# Altium project MiniBoard.PrjPCB
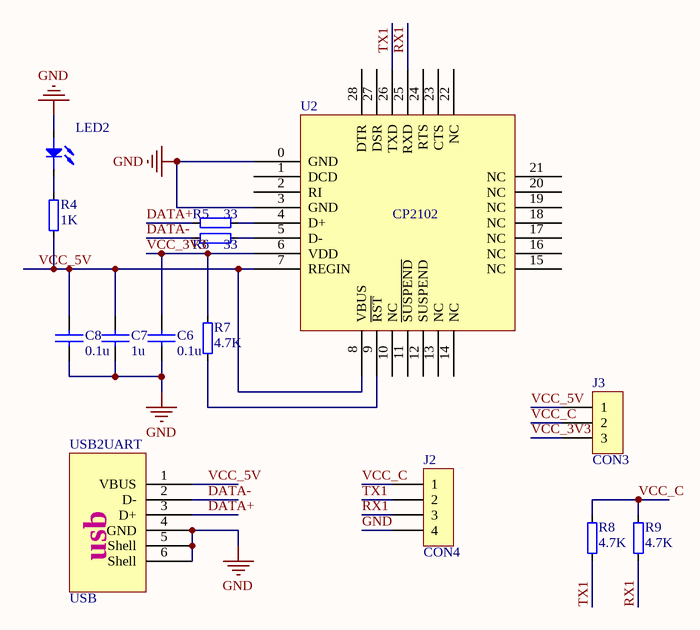
[diagram p0: CP2102.SchDoc]
5 sheets, 180 parts. Net scope: global (net labels, ports and power ports of the same name join across sheets).
Board file: MiniBoard.PcbDoc
Sheets:
  CP2102.SchDoc
  Max3232.SchDoc
  MiniBoard.SchDoc
  FM349readerV01.SchDoc
  Antanna.SchDoc

## Sheet CP2102.SchDoc
size A4

### Parts
(Parts that share a designator on the sheet are numbered #1, #2 ... from top to bottom, then left to right.)
C6  0.1u  [C0603]
C7  1u  [C0603]
C8  0.1u  [C0603]
J2#1  CON4  [HDR1X4]
J3#1  CON3  [HDR1X3]
LED2  (no value)  [LED0805]
R4#1  1K  [R0603]
R5#1  33  [R0603]
R6#1  33  [R0603]
R7#1  4.7K  [R0603]
R8#1  4.7K  [R0603]
R9#1  4.7K  [R0603]
U2#1  CP2102  [CP2102]
USB2UART  USB  [USB-B]

### Nets
GND: C6.2 C7.2 C8.2 J2#1.4 LED2.1 U2#1.0(GND) U2#1.3(GND) USB2UART.4(GND) USB2UART.5(Shell) USB2UART.6(Shell)
DATA+: R5#1.1 USB2UART.3(D+)
DATA-: R6#1.1 USB2UART.2(D-)
RX1: J2#1.3 R9#1.1 U2#1.25(RXD)
TX1: J2#1.2 R8#1.1 U2#1.26(TXD)
VCC_3V3: C6.1 J3#1.3 R7#1.2 U2#1.6(VDD)
VCC_5V: C7.1 C8.1 J3#1.1 R4#1.1 U2#1.7(REGIN) U2#1.8(VBUS) USB2UART.1(VBUS)
VCC_C: J2#1.1 J3#1.2 R8#1.2 R9#1.2
NetLED2_2: LED2.2 R4#1.2
NetR5#1_2: R5#1.2 U2#1.4(D+)
NetR6#1_2: R6#1.2 U2#1.5(D-)
NetR7#1_1: R7#1.1 U2#1.9(~{RST})

Not connected (* = marked no-connect by the designer): U2#1 1(DCD) 2(RI) 10(NC) 11(~{SUSPEND}) 12(SUSPEND) 13(NC) 14(NC) 15(NC) 16(NC) 17(NC) 18(NC) 19(NC) 20(NC) 21(NC) 22(NC) 23(CTS) 24(RTS) 27(DSR) 28(DTR)

### Notes on the sheet
- (in symbol USB) usb

### Library data of the parts
C6-C8 = CAP: Part Field 1: CAP X7R 100NF 10% 50V 0805; Part Field 2: AAPL; Part Field 3: 8124-10446-12
J2#1 = CON4: Connector
J3#1 = CON3: Connector
LED2 = LED
R4#1 R5#1 R6#1 = res
R7#1 R8#1 R9#1 = RES

## Sheet Max3232.SchDoc
size A4
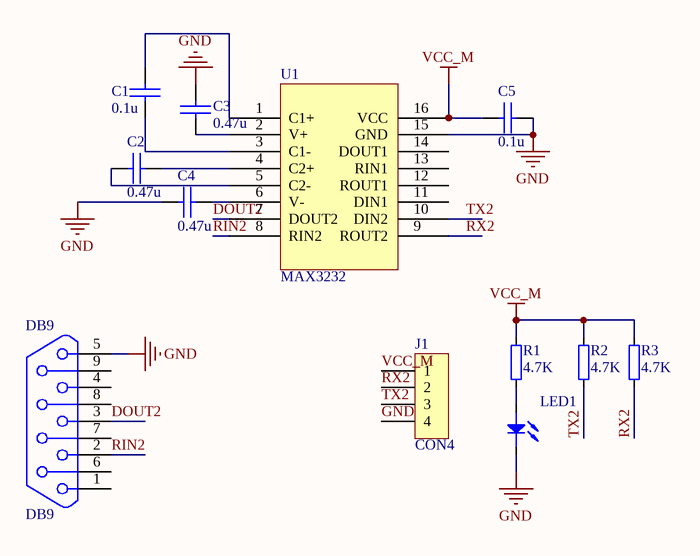
[diagram p1: Max3232.SchDoc]

### Parts
(Parts that share a designator on the sheet are numbered #1, #2 ... from top to bottom, then left to right.)
C1#1  0.1u  [C0603]
C2#1  0.47u  [C0603]
C3#1  0.47u  [C0603]
C4#1  0.47u  [C0603]
C5#1  0.1u  [C0603]
DB9  DB9  [DB9]
J1#1  CON4  [HDR1X4]
LED1  (no value)  [LED0805]
R1#1  4.7K  [R0603]
R2#1  4.7K  [R0603]
R3#1  4.7K  [R0603]
U1#1  MAX3232  [SSOP-16-SP3232]

### Nets
GND: C3#1.2 C4#1.1 C5#1.2 DB9.5 J1#1.4 LED1.2 U1#1.15(GND)
VCC_M: C5#1.1 J1#1.1 R1#1.2 R2#1.2 R3#1.2 U1#1.16(VCC)
DOUT2: DB9.3 U1#1.7(DOUT2)
RIN2: DB9.2 U1#1.8(RIN2)
RX2: J1#1.2 R3#1.1 U1#1.9(ROUT2)
TX2: J1#1.3 R2#1.1 U1#1.10(DIN2)
NetC1#1_1: C1#1.1 U1#1.3(C1-)
NetC1#1_2: C1#1.2 U1#1.1(C1+)
NetC2#1_1: C2#1.1 U1#1.5(C2-)
NetC2#1_2: C2#1.2 U1#1.4(C2+)
NetC3#1_1: C3#1.1 U1#1.2(V+)
NetC4#1_2: C4#1.2 U1#1.6(V-)
NetLED1_1: LED1.1 R1#1.1

Not connected (* = marked no-connect by the designer): DB9 1 4 6 7 8 9; U1#1 11(DIN1) 12(ROUT1) 13(RIN1) 14(DOUT1)

### Library data of the parts
C1#1 C2#1 C3#1 C4#1 C5#1 = CAP: Part Field 1: CAP X7R 100NF 10% 50V 0805; Part Field 2: AAPL; Part Field 3: 8124-10446-12
J1#1 = CON4: Connector
LED1 = LED
R1#1 = res
R2#1 R3#1 = RES

## Sheet MiniBoard.SchDoc
size A4
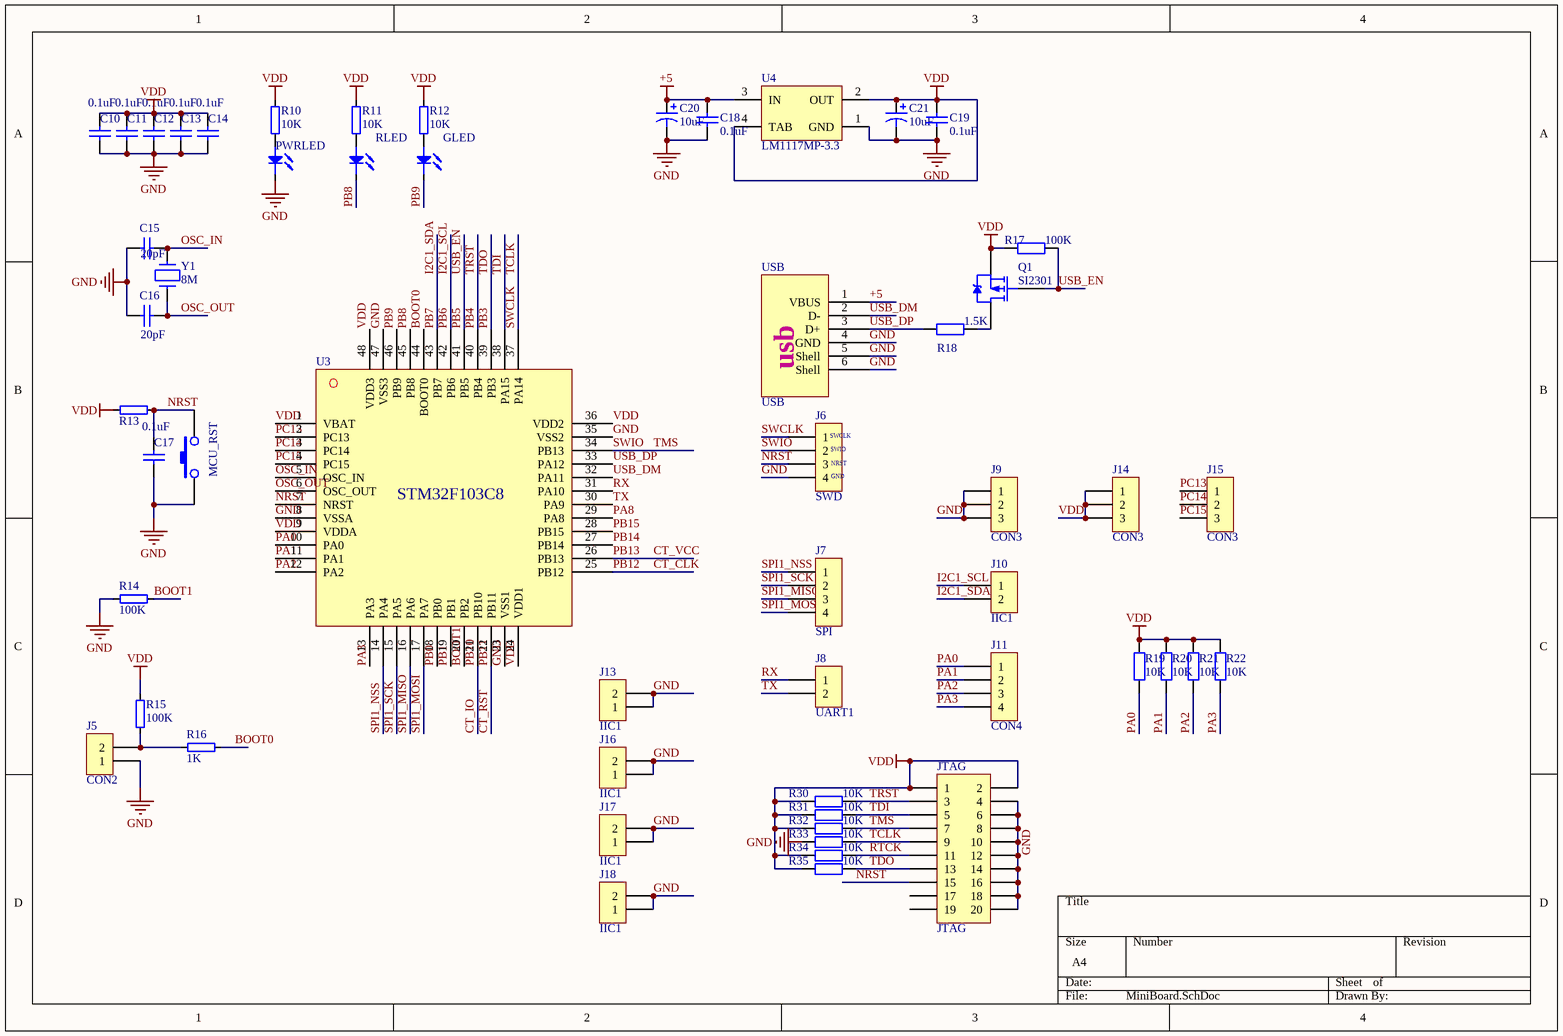
[diagram p2: MiniBoard.SchDoc]

### Parts
(Parts that share a designator on the sheet are numbered #1, #2 ... from top to bottom, then left to right.)
C10#1  0.1uF  [C0603]
C11#1  0.1uF  [C0603]
C12#1  0.1uF  [C0603]
C13  0.1uF  [C0603]
C14  0.1uF  [C0603]
C15  20pF  [C0603]
C16  20pF  [C0603]
C17  0.1uF  [C0603]
C18  0.1uF  [C0603]
C19  0.1uF  [C0603]
C20#1  10uF  [1210-A]
C21#1  10uF  [1210-A]
GLED  LED  [LED0805]  (value not drawn)
J5  CON2  [HDR1X2]
J6  SWD  [SWD]
J7  SPI  [HDR1X4]
J8  UART1  [HDR1X2]
J9  CON3  [HDR1X3]
J10  IIC1  [HDR1X2]
J11  CON4  [HDR1X4]
J13  IIC1  [HDR1X2]
J14  CON3  [HDR1X3]
J15  CON3  [HDR1X3]
J16  IIC1  [HDR1X2]
J17  IIC1  [HDR1X2]
J18  IIC1  [HDR1X2]
JTAG  JTAG  [HDR2X10]
MCU_RST#1  BUTTON  [BUTTON-S]  (value not drawn)
PWRLED  LED  [LED0805]  (value not drawn)
Q1#1  SI2301  [SOT-23-2301]
R10#1  10K  [R0603]
R11#1  10K  [R0603]
R12#1  10K  [R0603]
R13#1  10K  [R0603]  (value not drawn)
R14#1  100K  [R0603]
R15#1  100K  [R0603]
R16#1  1K  [R0603]
R17#1  100K  [R0603]
R18#1  1.5K  [R0603]
R19  10K  [R0603]
R20#1  10K  [R0603]
R21#1  10K  [R0603]
R22  10K  [R0603]
R30  10K  [R0603]
R31  10K  [R0603]
R32  10K  [R0603]
R33  10K  [R0603]
R34  10K  [R0603]
R35  10K  [R0603]
RLED  LED  [LED0805]  (value not drawn)
U3#1  STM32F103C8  [LQFP48_N]  (value not drawn)
U4#1  LM1117MP-3.3  [MP04A_L]
USB  USB  [USB-B]
Y1#1  8M  [XTAL]

### Nets
+5: C18.2 C20#1.1 U4#1.3(IN) USB.1(VBUS)
GND: C10#1.1 C11#1.1 C12#1.1 C13.1 C14.1 C15.2 C16.2 C17.1 C18.1 C19.1 C20#1.2 C21#1.2 J5.1 J6.4 J9.1 J9.2 J9.3 J13.1 J13.2 J16.1 J16.2 J17.1 J17.2 J18.1 J18.2 JTAG.4 JTAG.6 JTAG.8 JTAG.10 JTAG.12 JTAG.14 JTAG.16 JTAG.18 JTAG.20 MCU_RST#1.1 PWRLED.2 R14#1.2 R33.2 U3#1.8(VSSA) U3#1.23(VSS1) U3#1.35(VSS2) U3#1.47(VSS3) U4#1.1(GND) USB.4(GND) USB.5(Shell) USB.6(Shell)
VDD: C10#1.2 C11#1.2 C12#1.2 C13.2 C14.2 C19.2 C21#1.1 J14.1 J14.2 J14.3 JTAG.1 JTAG.2 Q1#1.3(S) R10#1.1 R11#1.2 R12#1.2 R13#1.1 R15#1.2 R17#1.1 R19.1 R20#1.1 R21#1.1 R22.1 R30.1 R31.1 R32.1 R34.1 R35.1 U3#1.1(VBAT) U3#1.9(VDDA) U3#1.24(VDD1) U3#1.36(VDD2) U3#1.48(VDD3) U4#1.2(OUT) U4#1.4(TAB)
BOOT0: R16#1.1 U3#1.44(BOOT0)
BOOT1: R14#1.1 U3#1.20(PB2)
CT_CLK: U3#1.25(PB12)  [also labelled PB12]
CT_IO: U3#1.21(PB10)  [also labelled PB10]
CT_RST: U3#1.22(PB11)  [also labelled PB11]
CT_VCC: U3#1.26(PB13)  [also labelled PB13]
I2C1_SCL: J10.1 U3#1.42(PB6)  [also labelled PB6]
I2C1_SDA: J10.2 U3#1.43(PB7)  [also labelled PB7]
NRST: C17.2 J6.3 JTAG.15 MCU_RST#1.2 R13#1.2 U3#1.7(NRST)
OSC_IN: C15.1 U3#1.5(OSC_IN) Y1#1.1
OSC_OUT: C16.1 U3#1.6(OSC_OUT) Y1#1.2
PA0: J11.1 R19.2 U3#1.10(PA0)
PA1: J11.2 R20#1.2 U3#1.11(PA1)
PA2: J11.3 R21#1.2 U3#1.12(PA2)
PA3: J11.4 R22.2 U3#1.13(PA3)
PA8: U3#1.29(PA8)
PB0: U3#1.18(PB0)
PB1: U3#1.19(PB1)
PB3: JTAG.13 R35.2 U3#1.39(PB3)  [also labelled TDO]
PB4: JTAG.3 R30.2 U3#1.40(PB4)  [also labelled TRST]
PB5: Q1#1.1(G) R17#1.2 U3#1.41(PB5)  [also labelled USB_EN]
PB8: RLED.2 U3#1.45(PB8)
PB9: GLED.2 U3#1.46(PB9)
PB14: U3#1.27(PB14)
PB15: U3#1.28(PB15)
PC13: J15.1 U3#1.2(PC13)
PC14: J15.2 U3#1.3(PC14)
PC15: J15.3 U3#1.4(PC15)
RTCK: JTAG.11 R34.2
RX: J8.1 U3#1.31(PA10)
SPI1_MISO: J7.3 U3#1.16(PA6)
SPI1_MOSI: J7.4 U3#1.17(PA7)
SPI1_NSS: J7.1 U3#1.14(PA4)
SPI1_SCK: J7.2 U3#1.15(PA5)
SWCLK: J6.1 JTAG.9 R33.1 U3#1.37(PA14)  [also labelled TCLK]
SWIO: J6.2 JTAG.7 R32.2 U3#1.34(PB13)  [also labelled TMS]
TDI: JTAG.5 R31.2 U3#1.38(PA15)
TX: J8.2 U3#1.30(PA9)
USB_DM: U3#1.32(PA11) USB.2(D-)
USB_DP: R18#1.1 U3#1.33(PA12) USB.3(D+)
NetGLED_1: GLED.1 R12#1.1
NetJ5_2: J5.2 R15#1.1 R16#1.2
NetPWRLED_1: PWRLED.1 R10#1.2
NetQ1#1_2: Q1#1.2(D) R18#1.2
NetR11#1_1: R11#1.1 RLED.1

Not connected (* = marked no-connect by the designer): JTAG 17 19

### Notes on the sheet
- (in symbol SWD) SWCLK; SWIO; NRST; GND
- (in symbol USB) usb

### Library data of the parts
C10#1 C11#1 C12#1 C13-C17 = CAP: Capacitor; Published: 8-Jun-2000; LatestRevisionDate: 17-Jul-2002; LatestRevisionNote: Re-released for DXP Platform.; PackageReference: RAD-0.3; Publisher: Altium Limited
  C10#1 C11#1 C12#1 C13 C14 C17: Value: 0.1uF
  C15 C16: Value: 20pF
C18 C19 = Cap: Capacitor; Published: 8-Jun-2000; LatestRevisionDate: 17-Jul-2002; LatestRevisionNote: Re-released for DXP Platform.; PackageReference: 0805; Publisher: Altium Limited; Value: 0.1uF
C20#1 C21#1 = Cap Pol1: Polarized Capacitor (Radial); Published: 8-Jun-2000; LatestRevisionDate: 17-Jul-2002; LatestRevisionNote: Re-released for DXP Platform.; PackageReference: 0805; Publisher: Altium Limited; Value: 10uF
J5 J8 J10 J13 J16-J18 = CON2: Connector
J6 = SWD: Connector
J7 = CON4: USART
J9 J14 J15 = CON3: Connector
J11 = CON4: Connector
JTAG = Header 10X2: Header, 10-Pin, Dual row; LatestRevisionDate: 17-Jul-2002; LatestRevisionNote: Re-released for DXP Platform.; Publisher: Altium Limited
Q1#1 = PMOS-2: P-Channel Power MOSFET; pin to pad: 2>3 3>2; Note: Pin 4 not drawn and electrically connected to Pin 2.; Published: 8-Jun-2000; LatestRevisionDate: 17-Jul-2002; LatestRevisionNote: Re-released for DXP Platform.; DatasheetDocument: PD-9.390D; PackageReference: SOT-23-2301; Publisher: Altium Limited; Code_JEDEC: TO-220-AB; ComponentLink1Description: Manufacturer Link; ComponentLink1URL: http://www.irf.com/
R10#1 R11#1 R12#1 R13#1 R14#1 R15#1 R16#1 = RES
R17#1 R18#1 R30-R35 = Res2: Resistor; Published: 8-Jun-2000; LatestRevisionDate: 17-Jul-2002; LatestRevisionNote: Re-released for DXP Platform.; PackageReference: 0805; Publisher: Altium Limited
  R17#1: Value: 100K
  R18#1: Value: 1.5K
  R30-R35: Value: 10K
R19 R20#1 R21#1 R22 = R: Value: 1K; Published: 8-Jun-2000; LatestRevisionDate: 17-Jul-2002; LatestRevisionNote: Re-released for DXP Platform.; PackageReference: AXIAL-0.4; Publisher: Altium Limited; PackageDescription: Axial Device, Thru-Hole; 2 Leads; 0.4 in Pin Spacing
U4#1 = LM1117MP-3.3: 800mA Low-Dropout Linear Regulator; Manufacturer: National Semiconductor; CompType: LDO IC; PackageTopMarking: XYTT*N05A; Published: 27-Nov-2008; DatasheetVersion: Apr-2006; PackageVersion: revB, Apr-2003; PackageReference: MP04A; Publisher: Altium Limited; PackageDescription: Molded SOT-223, 6.50 x 3.56 x 1.6mm Body, 4 Lead, 2.3mm Pitch; PartNumber: LM1117MP-3.3; RoHS: O; PinCount: 4; DigiKeyPartNumber: LM1117MP-3.3CT-ND; Code_JEDEC: TO-261-AA; Code_IPC: SOT223-4; ComponentLink1Description: LM1117 Datasheet; ComponentLink1URL: http://www.national.com/ds/LM/LM1117.pdf; ComponentLink2Description: LM1117 Web Page; ComponentLink2URL: http://www.national.com/pf/LM/LM1117.html; ComponentLink3Description: MP04A Package Page; ComponentLink3URL: http://www.national.com/packaging/folders/mp04a.html
Y1#1 = CRYSTAL

## Sheet FM349readerV01.SchDoc
size A3
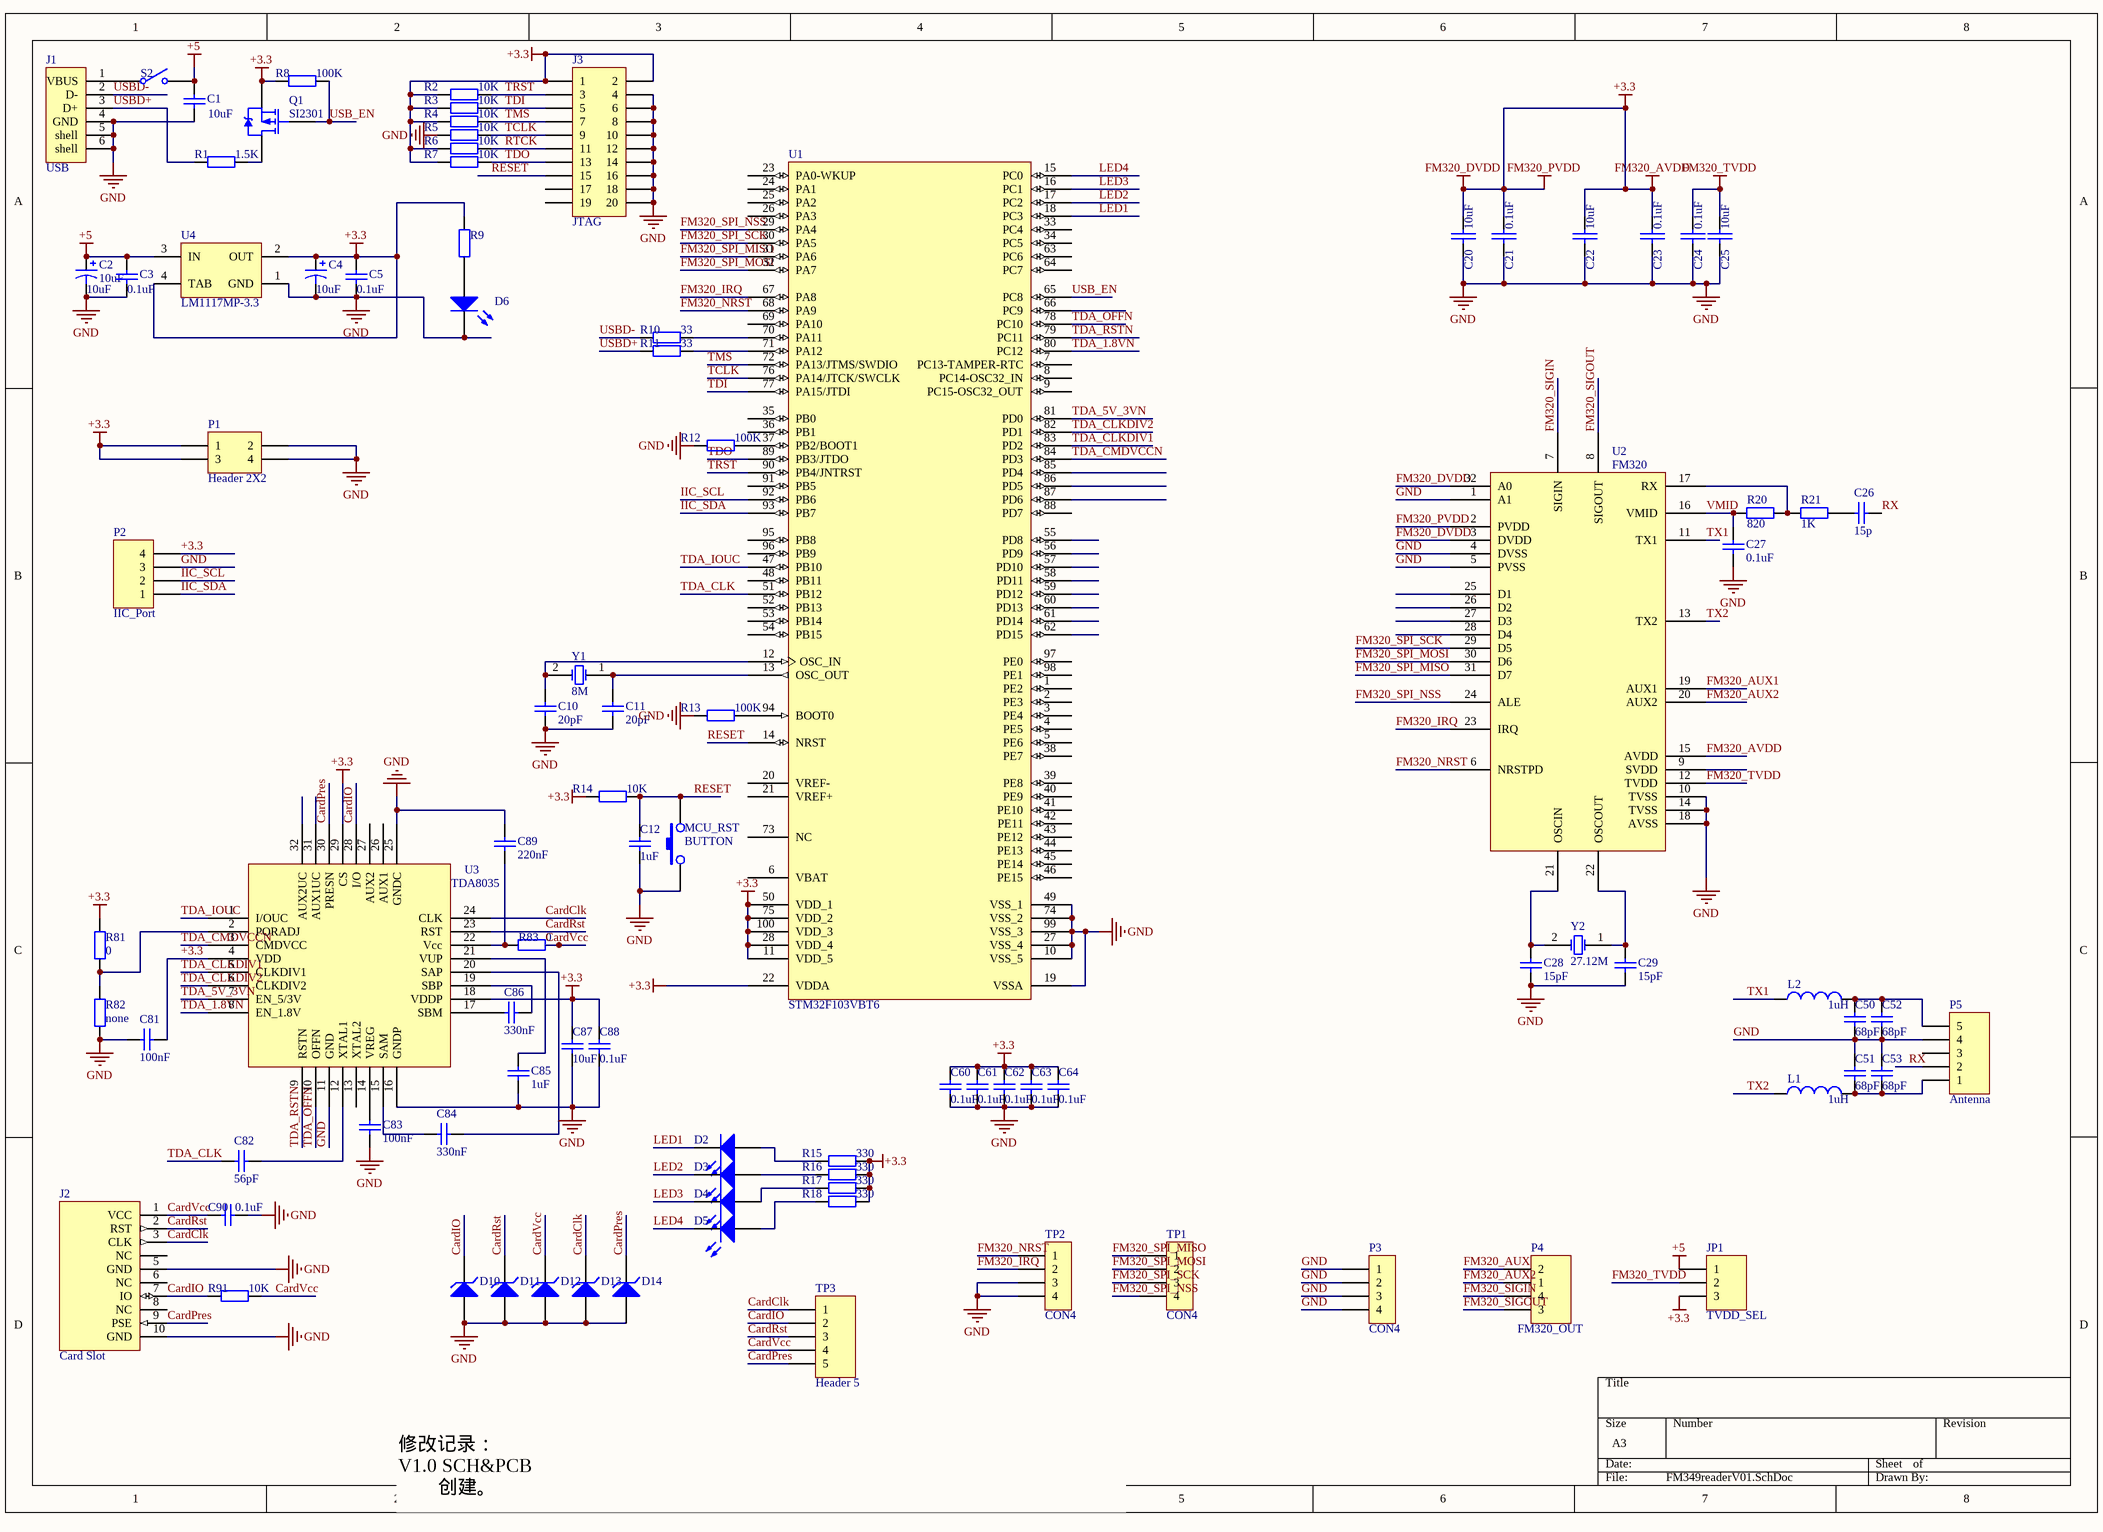
[diagram p3: FM349readerV01.SchDoc]

### Parts
(Parts that share a designator on the sheet are numbered #1, #2 ... from top to bottom, then left to right.)
C1#2  10uF  [0805]
C2#2  10uF  [0805]
C3#2  0.1uF  [0805]
C4#2  10uF  [0805]
C5#2  0.1uF  [0805]
C10#2  20pF  [0805]
C11#2  20pF  [0805]
C12#2  1uF  [0805]
C20#2  10uF  [0805]
C21#2  0.1uF  [0805]
C22  10uF  [0805]
C23  0.1uF  [0805]
C24  0.1uF  [0805]
C25  10uF  [0805]
C26  value 15p  [0805]  (hidden comment: 15pF)
C27  0.1uF  [0805]
C28  15pF  [0805]
C29  15pF  [0805]
C50  68pF  [0805]
C51  68pF  [0805]
C52  68pF  [0805]
C53  68pF  [0805]
C60  0.1uF  [0805]
C61  0.1uF  [0805]
C62  0.1uF  [0805]
C63  0.1uF  [0805]
C64  0.1uF  [0805]
C81  value 100nF  [0805]  (hidden comment: 0.1uF)
C82  56pF  [0805]
C83  value 100nF  [0805]  (hidden comment: 0.1uF)
C84  330nF  [0805]
C85  1uF  [0805]
C86  330nF  [0805]
C87  10uF  [0805]
C88  0.1uF  [0805]
C89  220nF  [0805]
C90  0.1uF  [0805]
D2  LED2  [3.2X1.6X1.1]  (value not drawn)
D3  LED2  [3.2X1.6X1.1]  (value not drawn)
D4  LED2  [3.2X1.6X1.1]  (value not drawn)
D5  LED2  [3.2X1.6X1.1]  (value not drawn)
D6  LED2  [3.2X1.6X1.1]  (value not drawn)
D10  ESD  [SOD-323]  (value not drawn)
D11  ESD  [SOD-323]  (value not drawn)
D12  ESD  [SOD-323]  (value not drawn)
D13  ESD  [SOD-323]  (value not drawn)
D14  ESD  [SOD-323]  (value not drawn)
J1#2  USB  [USB-B]
J2#2  Card Slot  [BIG-CARD-SLOT]
J3#2  JTAG  [HDR2X10]
JP1  TVDD_SEL  [HDR1X3]
L1  1uH  [1812]
L2  1uH  [1812]
MCU_RST#2  BUTTON  [BUTTON-S]
P1  Header 2X2  [HDR2X2]
P2  IIC_Port  [HDR1X4]
P3  CON4  [HDR1X4]
P4  FM320_OUT  [HDR1X4]
P5  Antenna  [HDR1X5]
Q1#2  SI2301  [SOT-23-2301]
R1#2  1.5K  [0805]
R2#2  10K  [0805]
R3#2  10K  [0805]
R4#2  10K  [0805]
R5#2  10K  [0805]
R6#2  10K  [0805]
R7#2  10K  [0805]
R8#2  100K  [0805]
R9#2  1.5K  [0805]  (value not drawn)
R10#2  33  [0805]
R11#2  33  [0805]
R12#2  100K  [0805]
R13#2  100K  [0805]
R14#2  10K  [0805]
R15#2  330  [0805]
R16#2  330  [0805]
R17#2  330  [0805]
R18#2  330  [0805]
R20#2  820  [0805]
R21#2  1K  [0805]
R81  0  [0805]
R82  value none  [0805]  (hidden comment: 0)
R83  0  [0805]
R91  10K  [0805]
S2  SW-SPST  [SW]  (value not drawn)
TP1  CON4  [HDR1X4]
TP2  CON4  [HDR1X4]
TP3  Header 5  [HDR1X5]
U1#2  STM32F103VBT6  [LQFP100_L]
U2#2  FM320  [FM320_PIN32]
U3#2  TDA8035  [TDA8035_PIN32]
U4#2  LM1117MP-3.3  [MP04A_L]
Y1#2  8M  [XTAL-0.2]
Y2  27.12M  [XTAL-0.2]

### Nets
+3.3: C4#2.1 C5#2.2 C20#2.2 C21#2.1 C22.1 C23.1 C60.2 C61.2 C62.2 C63.2 C64.2 C81.1 C87.2 C88.2 J3#2.1 J3#2.2 JP1.3 P1.1 P1.3 P2.4 Q1#2.3(S) R2#2.1 R3#2.1 R4#2.1 R6#2.1 R7#2.1 R8#2.1 R9#2.2 R14#2.1 R15#2.2 R16#2.1 R17#2.2 R18#2.2 R81.2 U1#2.11(VDD_5) U1#2.22(VDDA) U1#2.28(VDD_4) U1#2.50(VDD_1) U1#2.75(VDD_2) U1#2.100(VDD_3) U2#2.2(PVDD) U2#2.3(DVDD) U2#2.15(AVDD) U2#2.32(A0) U3#2.4(VDD) U3#2.18(VDDP) U3#2.29(CS) U4#2.2(OUT) U4#2.4(TAB)  [also labelled FM320_AVDD, FM320_DVDD, FM320_PVDD]
+5: C1#2.2 C2#2.1 C3#2.2 JP1.1 S2.2(NO) U4#2.3(IN)
FM320_TVDD: C24.1 C25.1 JP1.2 U2#2.12(TVDD)
GND: C1#2.1 C2#2.2 C3#2.1 C4#2.2 C5#2.1 C10#2.1 C11#2.1 C12#2.1 C20#2.1 C21#2.2 C22.2 C23.2 C24.2 C25.2 C27.2 C28.1 C29.1 C50.2 C51.1 C52.2 C53.1 C60.1 C61.1 C62.1 C63.1 C64.1 C81.2 C83.2 C85.1 C87.1 C88.1 C89.1 C90.2 D6.2(K) D10.1(A) D11.1(A) D12.1(A) D13.1(A) D14.1(A) J1#2.4(GND) J1#2.5(shell) J1#2.6(shell) J2#2.5(GND) J2#2.10(GND) J3#2.4 J3#2.6 J3#2.8 J3#2.10 J3#2.12 J3#2.14 J3#2.16 J3#2.18 J3#2.20 MCU_RST#2.1 P1.2 P1.4 P2.3 P3.1 P3.2 P3.3 P3.4 P5.4 R5#2.2 R12#2.1 R13#2.1 R82.1 TP2.3 TP2.4 U1#2.10(VSS_5) U1#2.19(VSSA) U1#2.27(VSS_4) U1#2.49(VSS_1) U1#2.74(VSS_2) U1#2.99(VSS_3) U2#2.1(A1) U2#2.4(DVSS) U2#2.5(PVSS) U2#2.10(TVSS) U2#2.14(TVSS) U2#2.18(AVSS) U3#2.11(GND) U3#2.16(GNDP) U3#2.25(GNDC) U4#2.1(GND)
CardClk: D13.2(K) J2#2.3(CLK) TP3.1 U3#2.24(CLK)
CardIO: D10.2(K) J2#2.7(IO) R91.1 TP3.2 U3#2.28(I/O)
CardPres: D14.2(K) J2#2.9(PSE) TP3.5 U3#2.30(PRESN)
CardRst: D11.2(K) J2#2.2(RST) TP3.3 U3#2.23(RST)
CardVcc: C90.1 D12.2(K) J2#2.1(VCC) R83.2 R91.2 TP3.4
FM320_AUX1: P4.2 U2#2.19(AUX1)
FM320_AUX2: P4.1 U2#2.20(AUX2)
FM320_IRQ: TP2.2 U1#2.67(PA8) U2#2.23(IRQ)
FM320_NRST: TP2.1 U1#2.68(PA9) U2#2.6(NRSTPD)
FM320_SIGIN: P4.4 U2#2.7(SIGIN)
FM320_SIGOUT: P4.3 U2#2.8(SIGOUT)
FM320_SPI_MISO: TP1.1 U1#2.31(PA6) U2#2.31(D7)
FM320_SPI_MOSI: TP1.2 U1#2.32(PA7) U2#2.30(D6)
FM320_SPI_NSS: TP1.4 U1#2.29(PA4) U2#2.24(ALE)
FM320_SPI_SCK: TP1.3 U1#2.30(PA5) U2#2.29(D5)
IIC_SCL: P2.2 U1#2.92(PB6)
IIC_SDA: P2.1 U1#2.93(PB7)
LED1: D2.2(K) U1#2.18(PC3)
LED2: D3.2(K) U1#2.17(PC2)
LED3: D4.2(K) U1#2.16(PC1)
LED4: D5.2(K) U1#2.15(PC0)
RESET: C12#2.2 J3#2.15 MCU_RST#2.2 R14#2.2 U1#2.14(NRST)
RTCK: J3#2.11 R6#2.2
RX: C26.1 P5.2
TCLK: J3#2.9 R5#2.1 U1#2.76(PA14/JTCK/SWCLK)  [project net SWCLK]
TDA_1.8VN: U1#2.80(PC12) U3#2.8(EN_1.8V)
TDA_5V_3VN: U1#2.81(PD0) U3#2.7(EN_5/3V)
TDA_CLK: C82.1 U1#2.51(PB12)
TDA_CLKDIV1: U1#2.83(PD2) U3#2.5(CLKDIV1)
TDA_CLKDIV2: U1#2.82(PD1) U3#2.6(CLKDIV2)
TDA_CMDVCCN: U1#2.84(PD3) U3#2.3(CMDVCC)
TDA_IOUC: U1#2.47(PB10) U3#2.1(I/OUC)
TDA_OFFN: U1#2.78(PC10) U3#2.10(OFFN)
TDA_RSTN: U1#2.79(PC11) U3#2.9(RSTN)
TDI: J3#2.5 R3#2.2 U1#2.77(PA15/JTDI)
TDO: J3#2.13 R7#2.2 U1#2.89(PB3/JTDO)  [project net PB3]
TMS: J3#2.7 R4#2.2 U1#2.72(PA13/JTMS/SWDIO)  [project net SWIO]
TRST: J3#2.3 R2#2.2 U1#2.90(PB4/JNTRST)  [project net PB4]
TX1: L2.1 U2#2.11(TX1)
TX2: L1.1 U2#2.13(TX2)
USB_EN: Q1#2.1(G) R8#2.2 U1#2.65(PC8)  [project net PB5]
USBD+: J1#2.3(D+) R1#2.1 R11#2.1
USBD-: J1#2.2(D-) R10#2.1
VMID: C27.1 R20#2.2 U2#2.16(VMID)
NetC10#2_2: C10#2.2 U1#2.12(OSC_IN) Y1#2.2(OSC2)
NetC11#2_2: C11#2.2 U1#2.13(OSC_OUT) Y1#2.1(OSC1)
NetC26_2: C26.2 R21#2.1
NetC28_2: C28.2 U2#2.21(OSCIN) Y2.2(OSC2)
NetC29_2: C29.2 U2#2.22(OSCOUT) Y2.1(OSC1)
NetC50_1: C50.1 C52.1 L2.2 P5.5
NetC51_2: C51.2 C53.2 L1.2 P5.1
NetC82_2: C82.2 U3#2.12(XTAL1)
NetC83_1: C83.1 U3#2.14(VREG)
NetC84_1: C84.1 U3#2.20(SAP)
NetC84_2: C84.2 U3#2.15(SAM)
NetC85_2: C85.2 U3#2.21(VUP)
NetC86_1: C86.1 U3#2.19(SBP)
NetC86_2: C86.2 U3#2.17(SBM)
NetC89_2: C89.2 R83.1 U3#2.22(Vcc)
NetD2_1: D2.1(A) R15#2.1
NetD3_1: D3.1(A) R16#2.2
NetD4_1: D4.1(A) R17#2.1
NetD5_1: D5.1(A) R18#2.1
NetD6_1: D6.1(A) R9#2.1
NetJ1#2_1: J1#2.1(VBUS) S2.1(COMMON)
NetQ1#2_2: Q1#2.2(D) R1#2.2
NetR10#2_2: R10#2.2 U1#2.70(PA11)
NetR11#2_2: R11#2.2 U1#2.71(PA12)
NetR12#2_2: R12#2.2 U1#2.37(PB2/BOOT1)
NetR13#2_2: R13#2.2 U1#2.94(BOOT0)
NetR20#2_1: R20#2.1 R21#2.2 U2#2.17(RX)
NetR81_1: R81.1 R82.2 U3#2.2(PORADJ)

Not connected (* = marked no-connect by the designer): J2#2 4(NC) 6(NC) 8(NC); J3#2 17 19; P5 3; U1#2 1(PE2) 2(PE3) 3(PE4) 4(PE5) 5(PE6) 6(VBAT) 7(PC13-TAMPER-RTC) 8(PC14-OSC32_IN) 9(PC15-OSC32_OUT) 20(VREF-) 21(VREF+) 23(PA0-WKUP) 24(PA1) 25(PA2) 26(PA3) 33(PC4) 34(PC5) 35(PB0) 36(PB1) 38(PE7) 39(PE8) 40(PE9) 41(PE10) 42(PE11) 43(PE12) 44(PE13) 45(PE14) 46(PE15) 48(PB11) 52(PB13) 53(PB14) 54(PB15) 55(PD8) 56(PD9) 57(PD10) 58(PD11) 59(PD12) 60(PD13) 61(PD14) 62(PD15) 63(PC6) 64(PC7) 66(PC9) 69(PA10) 73(NC) 85(PD4) 86(PD5) 87(PD6) 88(PD7) 91(PB5) 95(PB8) 96(PB9) 97(PE0) 98(PE1); U2#2 9(SVDD) 25(D1) 26(D2) 27(D3) 28(D4); U3#2 13(XTAL2) 26(AUX1) 27(AUX2) 31(AUX1UC) 32(AUX2UC)

### Notes on the sheet
- 修改记录：
  V1.0 SCH&PCB
  创建。

### Library data of the parts
C1#2 C3#2 C5#2 C10#2 C11#2 C12#2 C26-C29 C50-C53 C60-C64 C81-C90 = Cap: Capacitor; Published: 8-Jun-2000; LatestRevisionDate: 17-Jul-2002; LatestRevisionNote: Re-released for DXP Platform.; Publisher: Altium Limited
  C1#2 C87: PackageReference: 0805; Value: 10uF
  C3#2 C5#2 C88: PackageReference: 0805; Value: 0.1uF
  C10#2 C11#2: PackageReference: RAD-0.3; Value: 20pF
  C12#2: PackageReference: RAD-0.3; Value: 1uF
  C26: PackageReference: RAD-0.3
  C27 C60-C64 C90: PackageReference: RAD-0.3; Value: 0.1uF
  C28 C29: PackageReference: RAD-0.3; Value: 15pF
  C50-C53: PackageReference: 0805; Value: 68pF
  C81 C83: PackageReference: 0805
  C82: PackageReference: 0805; Value: 56pF
  C84 C86: PackageReference: 0805; Value: 330nF
  C85: PackageReference: 0805; Value: 1uF
  C89: PackageReference: 0805; Value: 220nF
C2#2 C4#2 = Cap Pol1: Polarized Capacitor (Radial); Published: 8-Jun-2000; LatestRevisionDate: 17-Jul-2002; LatestRevisionNote: Re-released for DXP Platform.; PackageReference: 0805; Publisher: Altium Limited; Value: 10uF
C20#2 C21#2 C22-C25 = CAP: Capacitor
D2-D6 = LED2: Typical RED, GREEN, YELLOW, AMBER GaAs LED; Published: 8-Jun-2000; LatestRevisionDate: 17-Jul-2002; LatestRevisionNote: Re-released for DXP Platform.; PackageDocument: Feb-2002; PackageReference: 3.2X1.6X1.1; Publisher: Altium Limited
D10-D14 = D Zener: Zener Diode; Published: 8-Jun-2000; LatestRevisionDate: 17-Jul-2002; LatestRevisionNote: Re-released for DXP Platform.; PackageReference: DIODE-0.7; Publisher: Altium Limited; PackageDescription: Diode, Thru-Hole; 2 Leads; 0.7 in Pin Spacing
J3#2 = Header 10X2: Header, 10-Pin, Dual row; LatestRevisionDate: 17-Jul-2002; LatestRevisionNote: Re-released for DXP Platform.; Publisher: Altium Limited
JP1 = Header 3: Header, 3-Pin; LatestRevisionDate: 17-Jul-2002; LatestRevisionNote: Re-released for DXP Platform.; Publisher: Altium Limited
L1 L2 = Inductor: Code_IEC: 1005; Published: 8-Jun-2000; LatestRevisionDate: 17-Jul-2002; LatestRevisionNote: Re-released for DXP Platform.; PackageReference: 1812; Publisher: Altium Limited; Code_JEITA: 0402; Value: 1uH
MCU_RST#2 = BUTTON: 乒乓球按键（压下后接通，松开自动断开），较大按键尺寸12mmX12mm选用BUTTON-L封装，较小尺寸6mmX6mm选用BUTTON-S封装
P1 = Header 2X2: Header, 2-Pin, Dual row; LatestRevisionDate: 17-Jul-2002; LatestRevisionNote: Re-released for DXP Platform.; Publisher: Altium Limited
P2 P4 = Header 4: Header, 4-Pin; LatestRevisionDate: 17-Jul-2002; LatestRevisionNote: Re-released for DXP Platform.; Publisher: Altium Limited
P3 TP1 TP2 = CON4: Connector
P5 TP3 = Header 5: Header, 5-Pin; LatestRevisionDate: 17-Jul-2002; LatestRevisionNote: Re-released for DXP Platform.; Publisher: Altium Limited
Q1#2 = PMOS-2: P-Channel Power MOSFET; pin to pad: 2>3 3>2; Note: Pin 4 not drawn and electrically connected to Pin 2.; Published: 8-Jun-2000; LatestRevisionDate: 17-Jul-2002; LatestRevisionNote: Re-released for DXP Platform.; DatasheetDocument: PD-9.390D; PackageReference: SOT-23-2301; Publisher: Altium Limited; Code_JEDEC: TO-220-AB; ComponentLink1Description: Manufacturer Link; ComponentLink1URL: http://www.irf.com/
R1#2 R2#2 R3#2 R4#2 R5#2 R6#2 R7#2 R8#2 R9#2 R10#2 R11#2 R12#2 R13#2 R14#2 R15#2 R16#2 R17#2 R18#2 R20#2 R21#2 R81-R83 R91 = Res2: Resistor; Published: 8-Jun-2000; LatestRevisionDate: 17-Jul-2002; LatestRevisionNote: Re-released for DXP Platform.; PackageReference: 0805; Publisher: Altium Limited
  R1#2: Value: 1.5K
  R2#2 R3#2 R4#2 R5#2 R6#2 R7#2 R14#2 R91: Value: 10K
  R8#2 R12#2 R13#2: Value: 100K
  R10#2 R11#2: Value: 33
  R15#2 R16#2 R17#2 R18#2: Value: 330
  R20#2: Value: 820
  R21#2: Value: 1K
  R81 R83: Value: 0
S2 = SW-SPST: Single-Pole, Single-Throw Switch; Published: 24-Mar-1999; LatestRevisionDate: 17-Jul-2002; LatestRevisionNote: Re-released for DXP Platform.; PackageReference: SPST-2; Publisher: Altium Limited; PackageDescription: Switch; 2 Leads
U1#2 = STM32F103VBT6: STM32 ARM-based 32-bit MCU with 64 Kbytes Flash, 100-pin LQFP, Industrial Temperature; Published: 30-May-2008; DatasheetVersion: rev6, Mar-2008; PackageVersion: Mar-2008; PackageReference: LQFP100; Publisher: Altium Limited; PackageDescription: 100-Pin Low-Profile Quad Flat Pack, 14 x 14 mm Body, 0.5 mm Pitch (LQFP100); ComponentLink1Description: Manufacturer Link; ComponentLink1URL: www.st.com/stm32; ComponentLink2Description: Datasheet; ComponentLink2URL: http://www.st.com/stonline/products/literature/ds/13587.pdf
U2#2 = PN5120A0HN1
U4#2 = LM1117MP-3.3: as U4#1 on sheet MiniBoard; Published: 27-Nov-2008; DatasheetVersion: Apr-2006; PackageVersion: revB, Apr-2003; PackageReference: MP04A; Publisher: Altium Limited; PackageDescription: Molded SOT-223, 6.50 x 3.56 x 1.6mm Body, 4 Lead, 2.3mm Pitch; PartNumber: LM1117MP-3.3; RoHS: O; PinCount: 4; DigiKeyPartNumber: LM1117MP-3.3CT-ND; Code_JEDEC: TO-261-AA; Code_IPC: SOT223-4; ComponentLink1Description: LM1117 Datasheet; ComponentLink1URL: http://www.national.com/ds/LM/LM1117.pdf; ComponentLink2Description: LM1117 Web Page; ComponentLink2URL: http://www.national.com/pf/LM/LM1117.html; ComponentLink3Description: MP04A Package Page; ComponentLink3URL: http://www.national.com/packaging/folders/mp04a.html
Y1#2 Y2 = XTAL: Crystal Oscillator; Published: 8-Jun-2000; LatestRevisionDate: 17-Jul-2002; LatestRevisionNote: Re-released for DXP Platform.; PackageReference: XTAL-0.2; Publisher: Altium Limited
J2#2 = Card Slot: LatestRevisionDate: 17-Jul-2002; LatestRevisionNote: Re-released for DXP Platform.; Publisher: Altium Limited

## Sheet Antanna.SchDoc
size A4
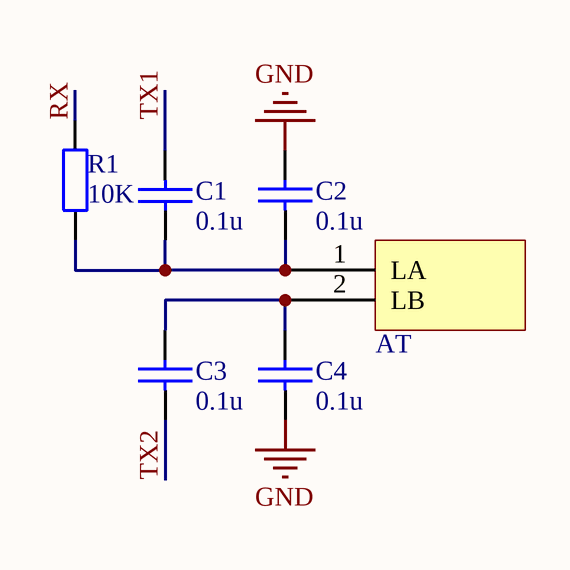
[diagram p4: Antanna.SchDoc]

### Parts
(Parts that share a designator on the sheet are numbered #1, #2 ... from top to bottom, then left to right.)
AT  Antanna13M56  (value not drawn)
C1#3  0.1u  [C0603]
C2#3  0.1u  [C0603]
C3#3  0.1u  [C0603]
C4#3  0.1u  [C0603]
R1#3  10K  [R0603]

### Nets
GND: C2#3.1 C4#3.2
RX: R1#3.1
TX1: C1#3.2
TX2: C3#3.2
NetAT_1: AT.1(LA) C1#3.1 C2#3.2 R1#3.2
NetAT_2: AT.2(LB) C3#3.1 C4#3.1

### Library data of the parts
C1#3 C2#3 C3#3 C4#3 = CAP: Part Field 1: CAP X7R 100NF 10% 50V 0805; Part Field 2: AAPL; Part Field 3: 8124-10446-12
R1#3 = R: Value: 1K; Published: 8-Jun-2000; LatestRevisionDate: 17-Jul-2002; LatestRevisionNote: Re-released for DXP Platform.; PackageReference: AXIAL-0.4; Publisher: Altium Limited; PackageDescription: Axial Device, Thru-Hole; 2 Leads; 0.4 in Pin Spacing

## Nets that join several sheets
+5: MiniBoard (C18.2 C20#1.1 U4#1.3 USB.1), FM349readerV01 (6 pins)
GND: CP2102 (10 pins), Max3232 (7 pins), MiniBoard (46 pins), FM349readerV01 (84 pins), Antanna (C2#3.1 C4#3.2)
PB3: MiniBoard (JTAG.13 R35.2 U3#1.39), FM349readerV01 (J3#2.13 R7#2.2 U1#2.89)
PB4: MiniBoard (JTAG.3 R30.2 U3#1.40), FM349readerV01 (J3#2.3 R2#2.2 U1#2.90)
PB5: MiniBoard (Q1#1.1 R17#1.2 U3#1.41), FM349readerV01 (Q1#2.1 R8#2.2 U1#2.65)
RTCK: MiniBoard (JTAG.11 R34.2), FM349readerV01 (J3#2.11 R6#2.2)
RX: MiniBoard (J8.1 U3#1.31), FM349readerV01 (C26.1 P5.2), Antanna (R1#3.1)
SWCLK: MiniBoard (J6.1 JTAG.9 R33.1 U3#1.37), FM349readerV01 (J3#2.9 R5#2.1 U1#2.76)
SWIO: MiniBoard (J6.2 JTAG.7 R32.2 U3#1.34), FM349readerV01 (J3#2.7 R4#2.2 U1#2.72)
TDI: MiniBoard (JTAG.5 R31.2 U3#1.38), FM349readerV01 (J3#2.5 R3#2.2 U1#2.77)
TX1: CP2102 (J2#1.2 R8#1.1 U2#1.26), FM349readerV01 (L2.1 U2#2.11), Antanna (C1#3.2)
TX2: Max3232 (J1#1.3 R2#1.1 U1#1.10), FM349readerV01 (L1.1 U2#2.13), Antanna (C3#3.2)